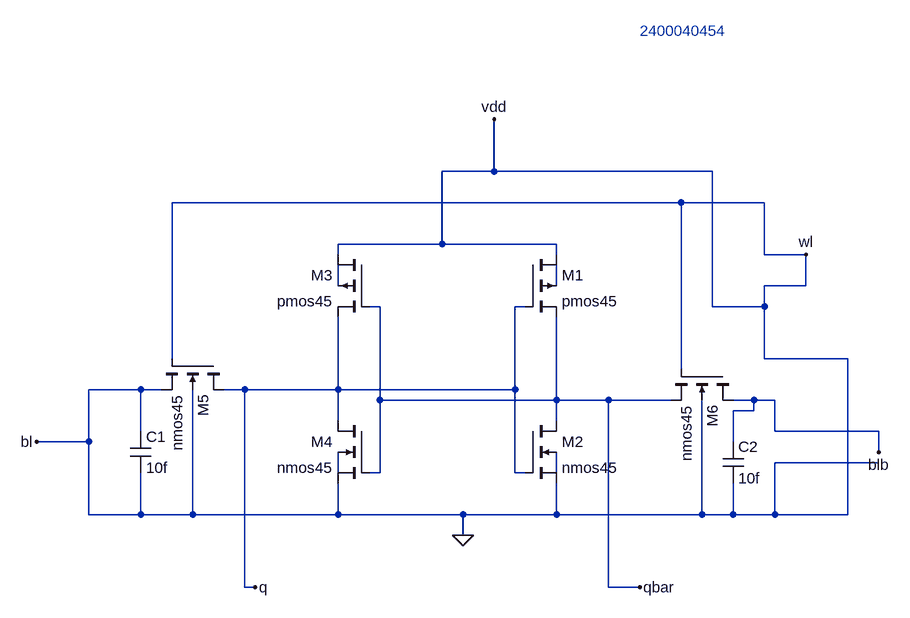
[diagram p0: schematic sram.asc]
sram.asc, the LTspice schematic file:
Version 4.1
SHEET 1 1028 680
WIRE 192 -368 192 -448
WIRE 192 -368 112 -368
WIRE 528 -368 192 -368
WIRE 480 -320 -304 -320
WIRE 608 -320 480 -320
WIRE 112 -256 112 -368
WIRE 112 -256 -48 -256
WIRE 288 -256 112 -256
WIRE -48 -240 -48 -256
WIRE 288 -240 288 -256
WIRE 608 -240 608 -320
WIRE 672 -240 608 -240
WIRE -48 -192 -48 -224
WIRE 288 -192 288 -224
WIRE 672 -192 672 -240
WIRE 672 -192 608 -192
WIRE 16 -160 0 -160
WIRE 240 -160 224 -160
WIRE 528 -160 528 -368
WIRE 608 -160 608 -192
WIRE 608 -160 528 -160
WIRE -304 -80 -304 -320
WIRE 608 -80 608 -160
WIRE 736 -80 608 -80
WIRE 480 -64 480 -320
WIRE -352 -32 -432 -32
WIRE -320 -32 -352 -32
WIRE -192 -32 -224 -32
WIRE -48 -32 -48 -144
WIRE -48 -32 -192 -32
WIRE 224 -32 224 -160
WIRE 224 -32 -48 -32
WIRE 16 -16 16 -160
WIRE 288 -16 288 -144
WIRE 288 -16 16 -16
WIRE 368 -16 288 -16
WIRE 464 -16 368 -16
WIRE 592 -16 560 -16
WIRE 624 -16 592 -16
WIRE 592 0 592 -16
WIRE 592 0 560 0
WIRE -48 16 -48 -32
WIRE 288 16 288 -16
WIRE -352 32 -352 -32
WIRE 624 32 624 -16
WIRE 784 32 624 32
WIRE -432 48 -432 -32
WIRE -432 48 -512 48
WIRE 560 48 560 0
WIRE 784 64 784 32
WIRE 784 80 624 80
WIRE -48 96 -48 64
WIRE 16 96 16 -16
WIRE 16 96 0 96
WIRE 224 96 224 -32
WIRE 240 96 224 96
WIRE 288 96 288 64
WIRE -432 160 -432 48
WIRE -352 160 -352 96
WIRE -352 160 -432 160
WIRE -272 160 -272 -32
WIRE -272 160 -352 160
WIRE -48 160 -48 112
WIRE -48 160 -272 160
WIRE 144 160 -48 160
WIRE 288 160 288 112
WIRE 288 160 144 160
WIRE 512 160 512 -16
WIRE 512 160 288 160
WIRE 560 160 560 112
WIRE 560 160 512 160
WIRE 624 160 624 80
WIRE 624 160 560 160
WIRE 736 160 736 -80
WIRE 736 160 624 160
WIRE 144 192 144 160
WIRE -192 272 -192 -32
WIRE -176 272 -192 272
WIRE 368 272 368 -16
WIRE 416 272 368 272
FLAG 144 192 0
FLAG 192 -448 vdd
FLAG 672 -240 wl
FLAG 784 64 blb
FLAG -512 48 bl
FLAG -176 272 q
FLAG 416 272 qbar
SYMBOL pmos4 240 -240 R0
SYMATTR InstName M1
SYMATTR Value pmos45
SYMATTR Value2 l=45n w=120n
SYMBOL nmos4 240 16 R0
SYMATTR InstName M2
SYMATTR Value nmos45
SYMATTR Value2 l=45n w=240n
SYMBOL pmos4 0 -240 M0
SYMATTR InstName M3
SYMATTR Value pmos45
SYMATTR Value2 l=45n w=120n
SYMBOL nmos4 0 16 M0
SYMATTR InstName M4
SYMATTR Value nmos45
SYMATTR Value2 l=45n w=240n
SYMBOL nmos4 -224 -80 R90
SYMATTR InstName M5
SYMATTR Value nmos45
SYMATTR Value2 l=45n w=120n
SYMBOL nmos4 560 -64 R90
SYMATTR InstName M6
SYMATTR Value nmos45
SYMATTR Value2 l=45n w=120n
SYMBOL cap 544 48 R0
SYMATTR InstName C2
SYMATTR Value 10f
SYMBOL cap -368 32 R0
SYMATTR InstName C1
SYMATTR Value 10f
TEXT 416 -584 Left 2 ;2400040454

The netlist it stands for:
* sram.asc
M1 0 q qbar N002 pmos45 l=45n w=120n
M2 qbar q 0 N004 nmos45 l=45n w=240n
M3 0 qbar q N001 pmos45 l=45n w=120n
M4 q qbar 0 N003 nmos45 l=45n w=240n
M5 q 0 0 0 nmos45 l=45n w=120n
M6 blb 0 qbar 0 nmos45 l=45n w=120n
C2 blb 0 10f
C1 0 0 10f
.model NMOS NMOS
.model PMOS PMOS
.lib standard.mos
* 2400040454
.backanno
.end